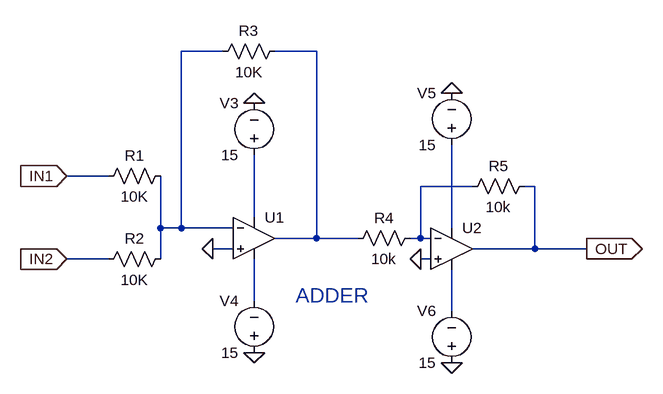
[diagram p0: schematic adderblock.asc]
adderblock.asc, the LTspice schematic file:
Version 4.1
SHEET 1 880 680
WIRE 48 -144 -16 -144
WIRE 192 -144 128 -144
WIRE -128 48 -192 48
WIRE 432 64 352 64
WIRE 528 64 512 64
WIRE 96 112 96 16
WIRE -48 128 -48 48
WIRE -16 128 -16 -144
WIRE -16 128 -48 128
WIRE 64 128 -16 128
WIRE 400 128 400 0
WIRE 192 144 192 -144
WIRE 192 144 128 144
WIRE 256 144 192 144
WIRE 352 144 352 64
WIRE 352 144 336 144
WIRE 368 144 352 144
WIRE 64 160 32 160
WIRE 528 160 528 64
WIRE 528 160 432 160
WIRE 608 160 528 160
WIRE -128 176 -192 176
WIRE -48 176 -48 128
WIRE 368 176 352 176
WIRE 96 240 96 176
WIRE 400 256 400 192
FLAG 32 160 0
FLAG 96 -64 0
FLAG 96 320 0
FLAG 352 176 0
FLAG 400 336 0
FLAG 400 -80 0
FLAG -192 48 IN1
IOPIN -192 48 In
FLAG -192 176 IN2
IOPIN -192 176 In
FLAG 608 160 OUT
IOPIN 608 160 Out
SYMBOL res -32 32 R90
WINDOW 0 0 56 VBottom 2
WINDOW 3 32 56 VTop 2
SYMATTR InstName R1
SYMATTR Value 10K
SYMBOL res -32 160 R90
WINDOW 0 0 56 VBottom 2
WINDOW 3 32 56 VTop 2
SYMATTR InstName R2
SYMATTR Value 10K
SYMBOL OpAmps\\UniversalOpAmp 96 144 R0
SYMATTR InstName U1
SYMBOL voltage 96 32 R180
WINDOW 0 24 96 Left 2
WINDOW 3 24 16 Left 2
WINDOW 123 0 0 Left 0
WINDOW 39 0 0 Left 0
SYMATTR InstName V3
SYMATTR Value 15
SYMBOL voltage 96 336 R180
WINDOW 0 24 96 Left 2
WINDOW 3 24 16 Left 2
WINDOW 123 0 0 Left 0
WINDOW 39 0 0 Left 0
SYMATTR InstName V4
SYMATTR Value 15
SYMBOL res 144 -160 R90
WINDOW 0 0 56 VBottom 2
WINDOW 3 32 56 VTop 2
SYMATTR InstName R3
SYMATTR Value 10K
SYMBOL OpAmps\\UniversalOpAmp 400 160 R0
SYMATTR InstName U2
SYMBOL res 352 128 R90
WINDOW 0 0 56 VBottom 2
WINDOW 3 32 56 VTop 2
SYMATTR InstName R4
SYMATTR Value 10k
SYMBOL res 528 48 R90
WINDOW 0 0 56 VBottom 2
WINDOW 3 32 56 VTop 2
SYMATTR InstName R5
SYMATTR Value 10k
SYMBOL voltage 400 16 R180
WINDOW 0 24 96 Left 2
WINDOW 3 24 16 Left 2
WINDOW 123 0 0 Left 0
WINDOW 39 0 0 Left 0
SYMATTR InstName V5
SYMATTR Value 15
SYMBOL voltage 400 352 R180
WINDOW 0 24 96 Left 2
WINDOW 3 24 16 Left 2
WINDOW 123 0 0 Left 0
WINDOW 39 0 0 Left 0
SYMATTR InstName V6
SYMATTR Value 15
TEXT 160 232 Left 3 ;ADDER

The netlist it stands for:
* adderblock.asc
R1 N001 IN1 10K
R2 N001 IN2 10K
X§U1 0 N001 N004 N006 N002 level1 Avol=1Meg GBW=10Meg Vos=0 En=0 Enk=0 In=0 Ink=0 Rin=500Meg  ; pins In+ In- V+ V- OUT
V3 N004 0 15
V4 0 N006 15
R3 N002 N001 10K
X§U2 0 N003 N005 N007 OUT level1 Avol=1Meg GBW=10Meg Vos=0 En=0 Enk=0 In=0 Ink=0 Rin=500Meg  ; pins In+ In- V+ V- OUT
R4 N003 N002 10k
R5 OUT N003 10k
V5 N005 0 15
V6 0 N007 15
* ADDER
.lib UniversalOpAmp1.lib
.backanno
.end